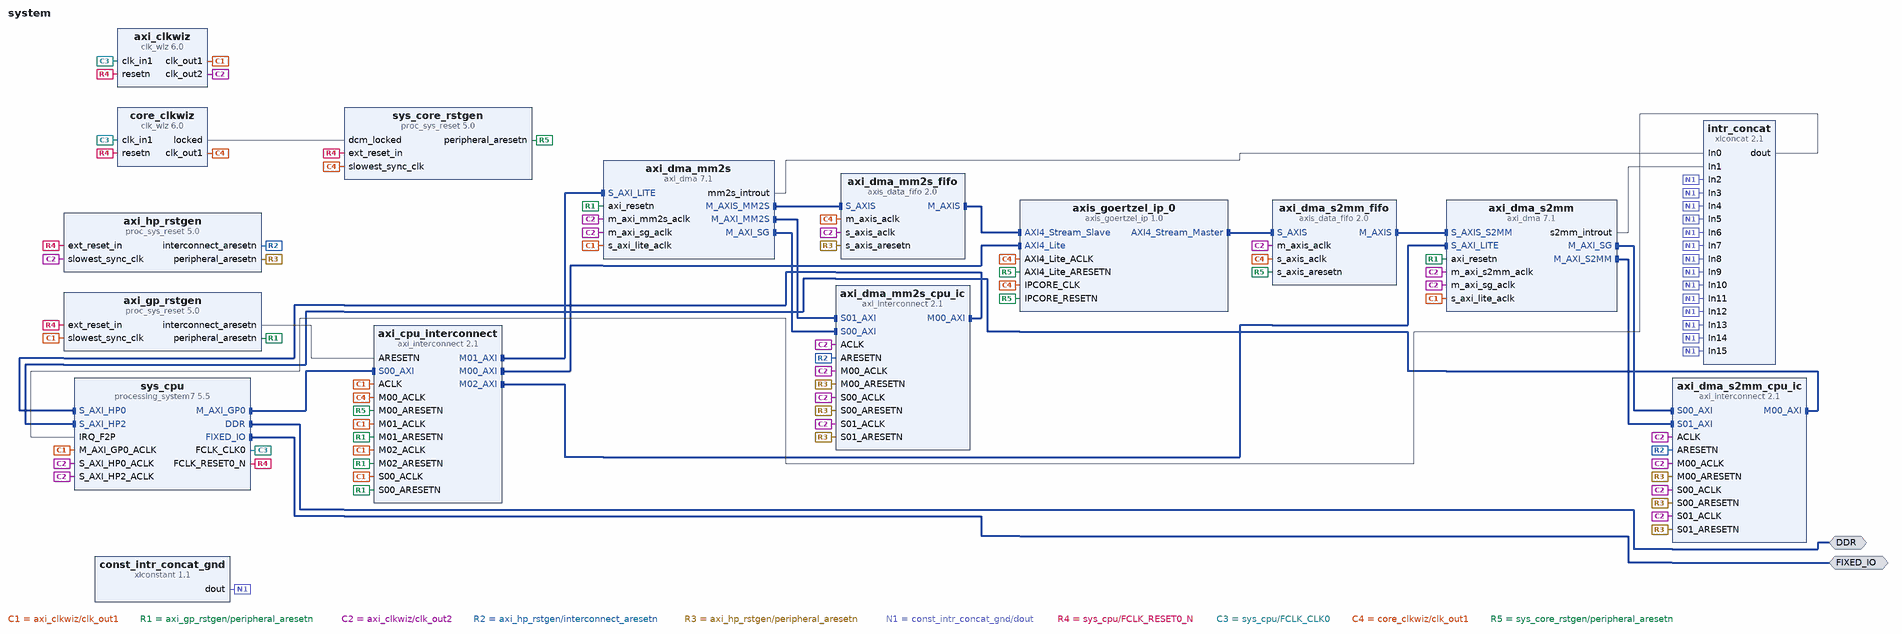
[diagram p0: block diagram of the top level]
# Vivado block design system, xc7z015clg485-1, Vivado 2019.1
create_bd_design system

create_bd_intf_port -mode Master -vlnv xilinx.com:interface:ddrx_rtl:1.0 DDR
create_bd_intf_port -mode Master -vlnv xilinx.com:display_processing_system7:fixedio_rtl:1.0 FIXED_IO

create_bd_cell -type ip -vlnv xilinx.com:ip:clk_wiz:6.0 axi_clkwiz
set_property -dict [list \
  CONFIG.CLKOUT1_REQUESTED_OUT_FREQ 50.000 \
  CONFIG.CLKOUT2_REQUESTED_OUT_FREQ 100.0 \
  CONFIG.CLKOUT2_USED true \
  CONFIG.PRIM_SOURCE Global_buffer \
  CONFIG.RESET_TYPE ACTIVE_LOW \
] [get_bd_cells axi_clkwiz]
create_bd_cell -type ip -vlnv xilinx.com:ip:axi_interconnect:2.1 axi_cpu_interconnect
set_property -dict [list \
  CONFIG.M01_HAS_DATA_FIFO 0 \
  CONFIG.M01_HAS_REGSLICE 4 \
  CONFIG.M02_HAS_DATA_FIFO 0 \
  CONFIG.M02_HAS_REGSLICE 4 \
  CONFIG.NUM_MI 3 \
  CONFIG.S00_HAS_REGSLICE 4 \
] [get_bd_cells axi_cpu_interconnect]
create_bd_cell -type ip -vlnv xilinx.com:ip:axi_dma:7.1 axi_dma_mm2s
set_property -dict [list \
  CONFIG.c_include_s2mm 0 \
  CONFIG.c_m_axi_mm2s_data_width 64 \
  CONFIG.c_m_axis_mm2s_tdata_width 32 \
  CONFIG.c_mm2s_burst_size 256 \
  CONFIG.c_sg_include_stscntrl_strm 0 \
  CONFIG.c_sg_length_width 23 \
] [get_bd_cells axi_dma_mm2s]
create_bd_cell -type ip -vlnv xilinx.com:ip:axi_interconnect:2.1 axi_dma_mm2s_cpu_ic
set_property -dict [list \
  CONFIG.M00_HAS_REGSLICE 4 \
  CONFIG.NUM_MI 1 \
  CONFIG.NUM_SI 2 \
  CONFIG.S00_HAS_REGSLICE 4 \
  CONFIG.S01_HAS_REGSLICE 4 \
] [get_bd_cells axi_dma_mm2s_cpu_ic]
create_bd_cell -type ip -vlnv xilinx.com:ip:axis_data_fifo:2.0 axi_dma_mm2s_fifo
set_property -dict [list \
  CONFIG.FIFO_DEPTH 2048 \
  CONFIG.IS_ACLK_ASYNC 1 \
  CONFIG.SYNCHRONIZATION_STAGES 3 \
] [get_bd_cells axi_dma_mm2s_fifo]
create_bd_cell -type ip -vlnv xilinx.com:ip:axi_dma:7.1 axi_dma_s2mm
set_property -dict [list \
  CONFIG.c_include_mm2s 0 \
  CONFIG.c_m_axi_s2mm_data_width 64 \
  CONFIG.c_s2mm_burst_size 256 \
  CONFIG.c_sg_include_stscntrl_strm 0 \
  CONFIG.c_sg_length_width 23 \
] [get_bd_cells axi_dma_s2mm]
create_bd_cell -type ip -vlnv xilinx.com:ip:axi_interconnect:2.1 axi_dma_s2mm_cpu_ic
set_property -dict [list \
  CONFIG.M00_HAS_REGSLICE 4 \
  CONFIG.NUM_MI 1 \
  CONFIG.NUM_SI 2 \
  CONFIG.S00_HAS_REGSLICE 4 \
  CONFIG.S01_HAS_REGSLICE 4 \
] [get_bd_cells axi_dma_s2mm_cpu_ic]
create_bd_cell -type ip -vlnv xilinx.com:ip:axis_data_fifo:2.0 axi_dma_s2mm_fifo
set_property -dict [list \
  CONFIG.FIFO_DEPTH 2048 \
  CONFIG.IS_ACLK_ASYNC 1 \
  CONFIG.SYNCHRONIZATION_STAGES 3 \
] [get_bd_cells axi_dma_s2mm_fifo]
create_bd_cell -type ip -vlnv xilinx.com:ip:proc_sys_reset:5.0 axi_gp_rstgen
set_property -dict {CONFIG.C_EXT_RST_WIDTH 1} [get_bd_cells axi_gp_rstgen]
create_bd_cell -type ip -vlnv xilinx.com:ip:proc_sys_reset:5.0 axi_hp_rstgen
set_property -dict {CONFIG.C_EXT_RST_WIDTH 1} [get_bd_cells axi_hp_rstgen]
create_bd_cell -type ip -vlnv xilinx.com:ip:xlconstant:1.1 const_intr_concat_gnd
set_property -dict {CONFIG.CONST_VAL 0 CONFIG.CONST_WIDTH 1} [get_bd_cells const_intr_concat_gnd]
create_bd_cell -type ip -vlnv xilinx.com:ip:clk_wiz:6.0 core_clkwiz
set_property -dict [list \
  CONFIG.CLKOUT1_REQUESTED_OUT_FREQ 25.000 \
  CONFIG.PRIM_SOURCE Global_buffer \
  CONFIG.RESET_TYPE ACTIVE_LOW \
] [get_bd_cells core_clkwiz]
create_bd_cell -type ip -vlnv xilinx.com:ip:xlconcat:2.1 intr_concat
set_property -dict {CONFIG.NUM_PORTS 16} [get_bd_cells intr_concat]
create_bd_cell -type ip -vlnv xilinx.com:ip:proc_sys_reset:5.0 sys_core_rstgen
set_property -dict {CONFIG.C_EXT_RST_WIDTH 1} [get_bd_cells sys_core_rstgen]
create_bd_cell -type ip -vlnv xilinx.com:ip:processing_system7:5.5 sys_cpu
set_property -dict [list \
  CONFIG.PCW_APU_PERIPHERAL_FREQMHZ 667 \
  CONFIG.PCW_ENET0_ENET0_IO {MIO 16 .. 27} \
  CONFIG.PCW_ENET0_GRP_MDIO_ENABLE 1 \
  CONFIG.PCW_ENET0_GRP_MDIO_IO {MIO 52 .. 53} \
  CONFIG.PCW_ENET0_PERIPHERAL_ENABLE 1 \
  CONFIG.PCW_ENET0_RESET_ENABLE 0 \
  CONFIG.PCW_ENET_RESET_ENABLE 1 \
  CONFIG.PCW_ENET_RESET_SELECT {Share reset pin} \
  CONFIG.PCW_EN_CLK1_PORT 1 \
  CONFIG.PCW_EN_RST1_PORT 1 \
  CONFIG.PCW_FPGA0_PERIPHERAL_FREQMHZ 100.0 \
  CONFIG.PCW_FPGA1_PERIPHERAL_FREQMHZ 200.0 \
  CONFIG.PCW_FPGA2_PERIPHERAL_FREQMHZ 33.333333 \
  CONFIG.PCW_FPGA_FCLK1_ENABLE 1 \
  CONFIG.PCW_GPIO_EMIO_GPIO_ENABLE 1 \
  CONFIG.PCW_GPIO_EMIO_GPIO_IO 32 \
  CONFIG.PCW_GPIO_EMIO_GPIO_WIDTH 32 \
  CONFIG.PCW_GPIO_MIO_GPIO_ENABLE 1 \
  CONFIG.PCW_GPIO_MIO_GPIO_IO MIO \
  CONFIG.PCW_GPIO_PERIPHERAL_ENABLE 1 \
  CONFIG.PCW_I2C_RESET_ENABLE 0 \
  CONFIG.PCW_IRQ_F2P_INTR 1 \
  CONFIG.PCW_PRESET_BANK1_VOLTAGE {LVCMOS 1.8V} \
  CONFIG.PCW_QSPI_GRP_FBCLK_ENABLE 1 \
  CONFIG.PCW_QSPI_GRP_FBCLK_IO {MIO 8} \
  CONFIG.PCW_QSPI_GRP_SINGLE_SS_ENABLE 1 \
  CONFIG.PCW_QSPI_GRP_SINGLE_SS_IO {MIO 1 .. 6} \
  CONFIG.PCW_QSPI_PERIPHERAL_ENABLE 1 \
  CONFIG.PCW_QSPI_QSPI_IO {MIO 1 .. 6} \
  CONFIG.PCW_SD0_GRP_CD_ENABLE 1 \
  CONFIG.PCW_SD0_GRP_CD_IO {MIO 46} \
  CONFIG.PCW_SD0_GRP_WP_ENABLE 0 \
  CONFIG.PCW_SD0_PERIPHERAL_ENABLE 1 \
  CONFIG.PCW_SD0_SD0_IO {MIO 40 .. 45} \
  CONFIG.PCW_SD1_PERIPHERAL_ENABLE 1 \
  CONFIG.PCW_SD1_SD1_IO {MIO 10 .. 15} \
  CONFIG.PCW_SDIO_PERIPHERAL_FREQMHZ 25 \
  CONFIG.PCW_SINGLE_QSPI_DATA_MODE x4 \
  CONFIG.PCW_UART1_PERIPHERAL_ENABLE 1 \
  CONFIG.PCW_UART1_UART1_IO {MIO 48 .. 49} \
  CONFIG.PCW_UART_PERIPHERAL_FREQMHZ 50 \
  CONFIG.PCW_UIPARAM_DDR_MEMORY_TYPE {DDR 3 (Low Voltage)} \
  CONFIG.PCW_UIPARAM_DDR_PARTNO {MT41K256M16 RE-125} \
  CONFIG.PCW_USB0_PERIPHERAL_ENABLE 1 \
  CONFIG.PCW_USB0_RESET_ENABLE 1 \
  CONFIG.PCW_USB0_RESET_IO {MIO 7} \
  CONFIG.PCW_USB0_USB0_IO {MIO 28 .. 39} \
  CONFIG.PCW_USB_RESET_ENABLE 1 \
  CONFIG.PCW_USB_RESET_SELECT {Share reset pin} \
  CONFIG.PCW_USE_FABRIC_INTERRUPT 1 \
  CONFIG.PCW_USE_S_AXI_HP0 1 \
  CONFIG.PCW_USE_S_AXI_HP2 1 \
] [get_bd_cells sys_cpu]
# 280 more settings of sys_cpu are not shown: defaults, MIO pin electricals, DDR timing, and values the tool derives
create_bd_cell -type ip -vlnv user.org:ip:axis_goertzel_ip:1.0 axis_goertzel_ip_0

# ---- connections ----

connect_bd_intf_net [get_bd_intf_pins axi_dma_mm2s_cpu_ic/M00_AXI] [get_bd_intf_pins sys_cpu/S_AXI_HP0]
connect_bd_intf_net [get_bd_intf_pins axi_dma_mm2s/M_AXIS_MM2S] [get_bd_intf_pins axi_dma_mm2s_fifo/S_AXIS]
connect_bd_intf_net [get_bd_intf_ports DDR] [get_bd_intf_pins sys_cpu/DDR]
connect_bd_intf_net [get_bd_intf_pins axi_dma_s2mm/M_AXI_SG] [get_bd_intf_pins axi_dma_s2mm_cpu_ic/S00_AXI]
connect_bd_intf_net [get_bd_intf_ports FIXED_IO] [get_bd_intf_pins sys_cpu/FIXED_IO]
connect_bd_intf_net [get_bd_intf_pins axi_cpu_interconnect/S00_AXI] [get_bd_intf_pins sys_cpu/M_AXI_GP0]
connect_bd_intf_net [get_bd_intf_pins axi_cpu_interconnect/M01_AXI] [get_bd_intf_pins axi_dma_mm2s/S_AXI_LITE]
connect_bd_intf_net [get_bd_intf_pins axi_dma_mm2s/M_AXI_MM2S] [get_bd_intf_pins axi_dma_mm2s_cpu_ic/S01_AXI]
connect_bd_intf_net [get_bd_intf_pins axi_dma_mm2s/M_AXI_SG] [get_bd_intf_pins axi_dma_mm2s_cpu_ic/S00_AXI]
connect_bd_intf_net [get_bd_intf_pins axi_cpu_interconnect/M02_AXI] [get_bd_intf_pins axi_dma_s2mm/S_AXI_LITE]
connect_bd_intf_net [get_bd_intf_pins axi_dma_s2mm/M_AXI_S2MM] [get_bd_intf_pins axi_dma_s2mm_cpu_ic/S01_AXI]
connect_bd_intf_net [get_bd_intf_pins axi_dma_s2mm/S_AXIS_S2MM] [get_bd_intf_pins axi_dma_s2mm_fifo/M_AXIS]
connect_bd_intf_net [get_bd_intf_pins axi_dma_s2mm_cpu_ic/M00_AXI] [get_bd_intf_pins sys_cpu/S_AXI_HP2]
connect_bd_intf_net [get_bd_intf_pins axis_goertzel_ip_0/AXI4_Lite] [get_bd_intf_pins axi_cpu_interconnect/M00_AXI]
connect_bd_intf_net [get_bd_intf_pins axis_goertzel_ip_0/AXI4_Stream_Master] [get_bd_intf_pins axi_dma_s2mm_fifo/S_AXIS]
connect_bd_intf_net [get_bd_intf_pins axis_goertzel_ip_0/AXI4_Stream_Slave] [get_bd_intf_pins axi_dma_mm2s_fifo/M_AXIS]
connect_bd_net -net axi_dma_mm2s_mm2s_introut_net [get_bd_pins axi_dma_mm2s/mm2s_introut] [get_bd_pins intr_concat/In0]
connect_bd_net -net axi_dma_s2mm_s2mm_introut_net [get_bd_pins axi_dma_s2mm/s2mm_introut] [get_bd_pins intr_concat/In1]
connect_bd_net -net axi_gp_clk [get_bd_pins axi_clkwiz/clk_out1] \
  [get_bd_pins axi_cpu_interconnect/ACLK] [get_bd_pins axi_cpu_interconnect/M01_ACLK] \
  [get_bd_pins axi_cpu_interconnect/M02_ACLK] [get_bd_pins axi_cpu_interconnect/S00_ACLK] \
  [get_bd_pins axi_dma_mm2s/s_axi_lite_aclk] [get_bd_pins axi_dma_s2mm/s_axi_lite_aclk] \
  [get_bd_pins axi_gp_rstgen/slowest_sync_clk] [get_bd_pins sys_cpu/M_AXI_GP0_ACLK]
connect_bd_net -net axi_gp_interconnect_resetn [get_bd_pins axi_gp_rstgen/interconnect_aresetn] [get_bd_pins axi_cpu_interconnect/ARESETN]
connect_bd_net -net axi_gp_resetn [get_bd_pins axi_gp_rstgen/peripheral_aresetn] \
  [get_bd_pins axi_cpu_interconnect/M01_ARESETN] [get_bd_pins axi_cpu_interconnect/M02_ARESETN] \
  [get_bd_pins axi_cpu_interconnect/S00_ARESETN] [get_bd_pins axi_dma_mm2s/axi_resetn] [get_bd_pins axi_dma_s2mm/axi_resetn]
connect_bd_net -net axi_hp_clk [get_bd_pins axi_clkwiz/clk_out2] \
  [get_bd_pins axi_dma_mm2s/m_axi_mm2s_aclk] [get_bd_pins axi_dma_mm2s/m_axi_sg_aclk] [get_bd_pins axi_dma_mm2s_cpu_ic/ACLK] \
  [get_bd_pins axi_dma_mm2s_cpu_ic/M00_ACLK] [get_bd_pins axi_dma_mm2s_cpu_ic/S00_ACLK] \
  [get_bd_pins axi_dma_mm2s_cpu_ic/S01_ACLK] [get_bd_pins axi_dma_mm2s_fifo/s_axis_aclk] \
  [get_bd_pins axi_dma_s2mm/m_axi_s2mm_aclk] [get_bd_pins axi_dma_s2mm/m_axi_sg_aclk] [get_bd_pins axi_dma_s2mm_cpu_ic/ACLK] \
  [get_bd_pins axi_dma_s2mm_cpu_ic/M00_ACLK] [get_bd_pins axi_dma_s2mm_cpu_ic/S00_ACLK] \
  [get_bd_pins axi_dma_s2mm_cpu_ic/S01_ACLK] [get_bd_pins axi_dma_s2mm_fifo/m_axis_aclk] \
  [get_bd_pins axi_hp_rstgen/slowest_sync_clk] [get_bd_pins sys_cpu/S_AXI_HP0_ACLK] [get_bd_pins sys_cpu/S_AXI_HP2_ACLK]
connect_bd_net -net axi_hp_interconnect_resetn [get_bd_pins axi_hp_rstgen/interconnect_aresetn] \
  [get_bd_pins axi_dma_mm2s_cpu_ic/ARESETN] [get_bd_pins axi_dma_s2mm_cpu_ic/ARESETN]
connect_bd_net -net axi_hp_resetn [get_bd_pins axi_hp_rstgen/peripheral_aresetn] \
  [get_bd_pins axi_dma_mm2s_cpu_ic/M00_ARESETN] [get_bd_pins axi_dma_mm2s_cpu_ic/S00_ARESETN] \
  [get_bd_pins axi_dma_mm2s_cpu_ic/S01_ARESETN] [get_bd_pins axi_dma_mm2s_fifo/s_axis_aresetn] \
  [get_bd_pins axi_dma_s2mm_cpu_ic/M00_ARESETN] [get_bd_pins axi_dma_s2mm_cpu_ic/S00_ARESETN] \
  [get_bd_pins axi_dma_s2mm_cpu_ic/S01_ARESETN]
connect_bd_net -net const_intr_concat_gnd [get_bd_pins const_intr_concat_gnd/dout] \
  [get_bd_pins intr_concat/In2] [get_bd_pins intr_concat/In3] [get_bd_pins intr_concat/In4] [get_bd_pins intr_concat/In5] \
  [get_bd_pins intr_concat/In6] [get_bd_pins intr_concat/In7] [get_bd_pins intr_concat/In8] [get_bd_pins intr_concat/In9] \
  [get_bd_pins intr_concat/In10] [get_bd_pins intr_concat/In11] [get_bd_pins intr_concat/In12] [get_bd_pins intr_concat/In13] \
  [get_bd_pins intr_concat/In14] [get_bd_pins intr_concat/In15]
connect_bd_net -net core_clkwiz_locked_net [get_bd_pins core_clkwiz/locked] [get_bd_pins sys_core_rstgen/dcm_locked]
connect_bd_net [get_bd_pins intr_concat/dout] [get_bd_pins sys_cpu/IRQ_F2P]
connect_bd_net -net proc_100m_resetn [get_bd_pins sys_cpu/FCLK_RESET0_N] \
  [get_bd_pins axi_clkwiz/resetn] [get_bd_pins axi_gp_rstgen/ext_reset_in] [get_bd_pins axi_hp_rstgen/ext_reset_in] \
  [get_bd_pins core_clkwiz/resetn] [get_bd_pins sys_core_rstgen/ext_reset_in]
connect_bd_net -net sys_100m_clk [get_bd_pins sys_cpu/FCLK_CLK0] [get_bd_pins axi_clkwiz/clk_in1] [get_bd_pins core_clkwiz/clk_in1]
connect_bd_net -net sys_core_clk [get_bd_pins core_clkwiz/clk_out1] \
  [get_bd_pins axi_cpu_interconnect/M00_ACLK] [get_bd_pins axi_dma_mm2s_fifo/m_axis_aclk] \
  [get_bd_pins axi_dma_s2mm_fifo/s_axis_aclk] [get_bd_pins sys_core_rstgen/slowest_sync_clk] \
  [get_bd_pins axis_goertzel_ip_0/AXI4_Lite_ACLK] [get_bd_pins axis_goertzel_ip_0/IPCORE_CLK]
connect_bd_net -net sys_core_resetn [get_bd_pins sys_core_rstgen/peripheral_aresetn] \
  [get_bd_pins axi_cpu_interconnect/M00_ARESETN] [get_bd_pins axi_dma_s2mm_fifo/s_axis_aresetn] \
  [get_bd_pins axis_goertzel_ip_0/AXI4_Lite_ARESETN] [get_bd_pins axis_goertzel_ip_0/IPCORE_RESETN]

# ---- address map ----
assign_bd_address -offset 0x00000000 -range 1G -target_address_space [get_bd_addr_spaces axi_dma_mm2s/Data_MM2S] [get_bd_addr_segs sys_cpu/S_AXI_HP0/HP0_DDR_LOWOCM]
assign_bd_address -offset 0x00000000 -range 1G -target_address_space [get_bd_addr_spaces axi_dma_mm2s/Data_SG] [get_bd_addr_segs sys_cpu/S_AXI_HP0/HP0_DDR_LOWOCM]
assign_bd_address -offset 0x00000000 -range 1G -target_address_space [get_bd_addr_spaces axi_dma_s2mm/Data_S2MM] [get_bd_addr_segs sys_cpu/S_AXI_HP2/HP2_DDR_LOWOCM]
assign_bd_address -offset 0x00000000 -range 1G -target_address_space [get_bd_addr_spaces axi_dma_s2mm/Data_SG] [get_bd_addr_segs sys_cpu/S_AXI_HP2/HP2_DDR_LOWOCM]
assign_bd_address -offset 0x40010000 -range 64K -target_address_space [get_bd_addr_spaces sys_cpu/Data] [get_bd_addr_segs axis_goertzel_ip_0/AXI4_Lite/reg0]
assign_bd_address -offset 0x40020000 -range 4K -target_address_space [get_bd_addr_spaces sys_cpu/Data] [get_bd_addr_segs axi_dma_mm2s/S_AXI_LITE/Reg]
assign_bd_address -offset 0x40030000 -range 4K -target_address_space [get_bd_addr_spaces sys_cpu/Data] [get_bd_addr_segs axi_dma_s2mm/S_AXI_LITE/Reg]

validate_bd_design
save_bd_design
